# EAGLE schematic T09_Signal Senders_Build (EAGLE 6.3)
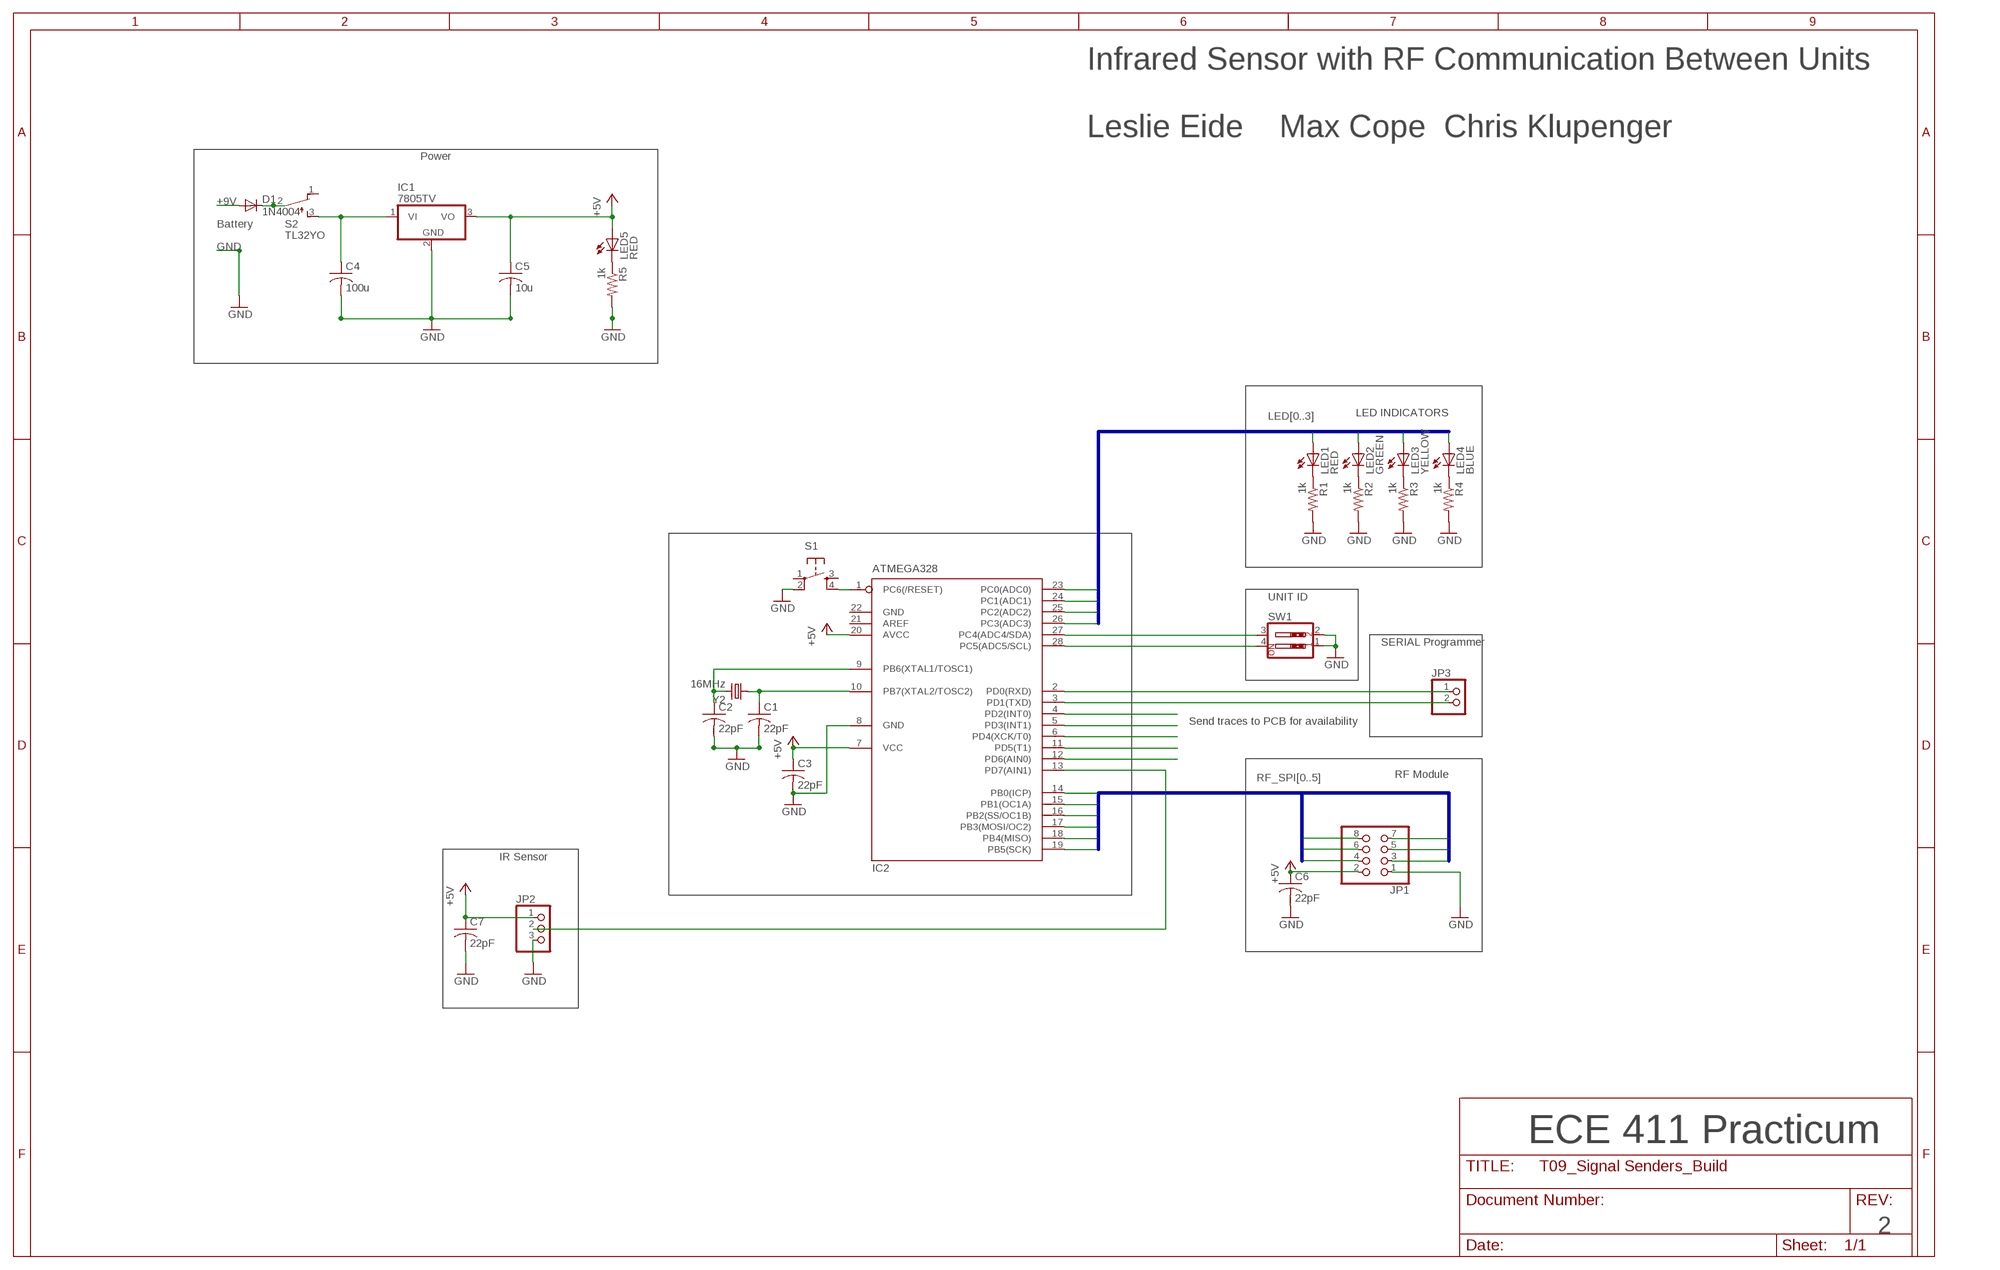
[diagram p0: schematic, sheet 1]

## Parts
C1  22pF  C-USC0805  [C0805]
C2  22pF  C-USC0805  [C0805]
C3  22pF  C-USC0805  [C0805]
C4  100u  C-US025-025X050  [C025-025X050]
C5  10u  C-US025-025X050  [C025-025X050]
C6  22pF  C-USC0805  [C0805]
C7  22pF  C-USC0805  [C0805]
D1  1N4004  [DO41-10]
IC1  7805TV  [TO220V]
IC2  ATMEGA328  MEGA8-P  [DIL28-3]
JP1  PINHD-2X3  [2X03]
JP2  PINHD-1X3  [1X03]
JP3  PINHD-1X2  [1X02]
LED1  RED  LED3MM  [LED3MM]
LED2  GREEN  LED3MM  [LED3MM]
LED3  YELLOW  LED3MM  [LED3MM]
LED4  BLUE  LED3MM  [LED3MM]
LED5  RED  LED3MM  [LED3MM]
R1  1k  R-US_M0805  [M0805]
R2  1k  R-US_M0805  [M0805]
R3  1k  R-US_M0805  [M0805]
R4  1k  R-US_M0805  [M0805]
R5  1k  R-US_M0805  [M0805]
S1  TAC_SWITCHPTH  [TACTILE-PTH]
S2  TL32YO  [TL3XYO]
SW1  SW_DIP-2  [EDG-02]
Y2  16MHz  CRYSTALHC49US  [HC49US]

## Nets
+5V: C3.1 C5.1 C6.1 C7.1 IC1.3(VO) IC2.7(VCC) IC2.20(AVCC) JP1.2 JP2.1 LED5.A
+9V: D1.A
GND: C1.2 C2.2 C3.2 C4.2 C5.2 C6.2 C7.2 IC1.2(GND) IC2.8(GND) JP1.1 JP2.3 R1.2 R2.2 R3.2 R4.2 R5.2 S1.2 SW1.1 SW1.2
LED0: IC2.23(PC0(ADC0)) LED1.A
LED1: IC2.24(PC1(ADC1)) LED2.A
LED2: IC2.25(PC2(ADC2)) LED3.A
LED3: IC2.26(PC3(ADC3)) LED4.A
N$1: IC2.1(PC6(/RESET)) S1.4
N$2: C1.1 IC2.10(PB7(XTAL2/TOSC2)) Y2.1
N$3: C2.1 IC2.9(PB6(XTAL1/TOSC1)) Y2.2
N$4: IC2.13(PD7(AIN1)) JP2.2
N$5: LED1.K(C) R1.1
N$6: LED2.K(C) R2.1
N$7: LED3.K(C) R3.1
N$8: LED4.K(C) R4.1
N$9: IC2.27(PC4(ADC4/SDA)) SW1.3
N$10: IC2.28(PC5(ADC5/SCL)) SW1.4
N$11: IC2.4(PD2(INT0))
N$12: IC2.5(PD3(INT1))
N$13: IC2.2(PD0(RXD)) JP3.1
N$14: IC2.3(PD1(TXD)) JP3.2
N$15: IC2.6(PD4(XCK/T0))
N$16: IC2.11(PD5(T1))
N$17: IC2.12(PD6(AIN0))
N$18: LED5.K(C) R5.1
N$22: C4.1 IC1.1(VI) S2.3(S)
N$23: D1.C S2.2(P)
RF_SPI0: IC2.14(PB0(ICP)) JP1.3
RF_SPI1: IC2.15(PB1(OC1A)) JP1.4
RF_SPI2: IC2.16(PB2(SS/OC1B)) JP1.5
RF_SPI3: IC2.17(PB3(MOSI/OC2)) JP1.6
RF_SPI4: IC2.18(PB4(MISO)) JP1.7
RF_SPI5: IC2.19(PB5(SCK)) JP1.8
Unconnected: IC2.21(AREF) S1.1 S1.3 S2.1(O)

## Buses
LED[0..3]
RF_SPI[0..5]

## Notes on the sheet
- Infrared Sensor with RF Communication Between Units
  
  Leslie Eide    Max Cope  Chris Klupenger
- Power
- Battery
- LED INDICATORS
- UNIT ID
- SERIAL Programmer
- Send traces to PCB for availability
- RF Module
- IR Sensor
- ECE 411 Practicum
- 2

## Power pins joined to a net without a drawn wire
GND: IC2.22(GND)

## Library data of the parts
C1-C7 = rcl:C-US: CAPACITOR, American symbol
D1 = diode:1N4004: DIODE general purpose rectifier, 1 A
IC1 = linear:78*: Positive VOLTAGE REGULATOR Source: http://cache.national.com/ds/LM/LM78L05.pdf http://www.fairchildsemi.com/ds/LM/LM7805.pdf
IC2 = atmel:MEGA8-P: MICROCONTROLLER 8 Kbytes FLASH, 1 kbytes SRAM, 512 bytes EEPROM, USART, 4-channel 10 bit ADC, 2-channel 8 bit ADC Pin compatible with Atmega48, ATMega88, ATMega168 Source: avr.lbr; OC_FARNELL: unknown; OC_NEWARK: unknown
JP1 = pinhead:PINHD-2X3: PIN HEADER
JP2 = pinhead:PINHD-1X3: PIN HEADER
JP3 = pinhead:PINHD-1X2: PIN HEADER
LED1-LED5 = led:LED: LED OSRAM: - CHIPLED LG R971, LG N971, LY N971, LG Q971, LY Q971, LO R971, LY R971 LH N974, LH R974 LS Q976, LO Q976, LY Q976 LO Q996 - Hyper CHIPLED LW Q18S LB Q993, LB Q99A, LB R99A - SideLED LS A670, LO A670, LY A670, LG A670, LP A670 LB A673, LV A673, LT A673, LW A673 LH A674 LY A675 LS A676, LA A676, LO A676, LY A676, LW A676 LS A679, LY A679, LG A679 - Hyper Micro SIDELED® LS Y876, LA Y876, LO Y876, LY Y876 LT Y87S - SmartLED LW L88C, LW L88S LB L89C, LB L89S, LG L890 LS L89K, LO L89K, LY L89K LS L896, LA L896, LO L896, LY L896 - TOPLED LS T670, LO T670, LY T670, LG T670, LP T670 LSG T670, LSP T670, LSY T670, LOP T670, LYG T670 LG T671, LOG T671, LSG T671 LB T673, LV T673, LT T673, LW T673 LH T674 LS T676, LA T676, LO T676, LY T676, LB T676, LH T676, LSB T676, LW T676 LB T67C, LV T67C, LT T67C, LS T67K, LO T67K, LY T67K, LW E67C LS E67B, LA E67B, LO E67B, LY E67B, LB E67C, LV E67C, LT E67C LW T67C LS T679, LY T679, LG T679 LS T770, LO T770, LY T770, LG T770, LP T770 LB T773, LV T773, LT T773, LW T773 LH T774 LS E675, LA E675, LY E675, LS T675 LS T776, LA T776, LO T776, LY T776, LB T776 LHGB T686 LT T68C, LB T68C - Hyper Mini TOPLED® LB M676 - Mini TOPLED Santana® LG M470 LS M47K, LO M47K, LY M47K Source: http://www.osram.convergy.de LUXEON: - LUMILED® LXK2-PW12-R00, LXK2-PW12-S00, LXK2-PW14-U00, LXK2-PW14-V00 LXK2-PM12-R00, LXK2-PM12-S00, LXK2-PM14-U00 LXK2-PE12-Q00, LXK2-PE12-R00, LXK2-PE12-S00, LXK2-PE14-T00, LXK2-PE14-U00 LXK2-PB12-K00, LXK2-PB12-L00, LXK2-PB12-M00, LXK2-PB14-N00, LXK2-PB14-P00, LXK2-PB14-Q00 LXK2-PR12-L00, LXK2-PR12-M00, LXK2-PR14-Q00, LXK2-PR14-R00 LXK2-PD12-Q00, LXK2-PD12-R00, LXK2-PD12-S00 LXK2-PH12-R00, LXK2-PH12-S00 LXK2-PL12-P00, LXK2-PL12-Q00, LXK2-PL12-R00 Source: www.luxeon.com KINGBRIGHT: KA-3528ASYC Source: www.kingbright.com
R1-R5 = rcl:R-US_: RESISTOR, American symbol
S1 = SparkFun-Electromechanical:TAC_SWITCH: Momentary Switch Button commonly used for reset or general input. Spark Fun Electronics SKU : COM-00097 SMT- SWCH-08247
S2 = switch:TL32YO: TINY SWITCH ON - MOM Source: http://www2.produktinfo.conrad.com/datenblaetter/700000-724999/705152-da-01-de-Subminiaturschalter_TL_36YO.pdf
SW1 = special:SW_DIP-2: DIP SWITCH
Y2 = SparkFun-FreqCtrl:CRYSTAL: Various standard crystals. Proven footprints. Spark Fun Electronics SKU : COM-00534